# EAGLE design encoder_board (EAGLE 8.6.0)
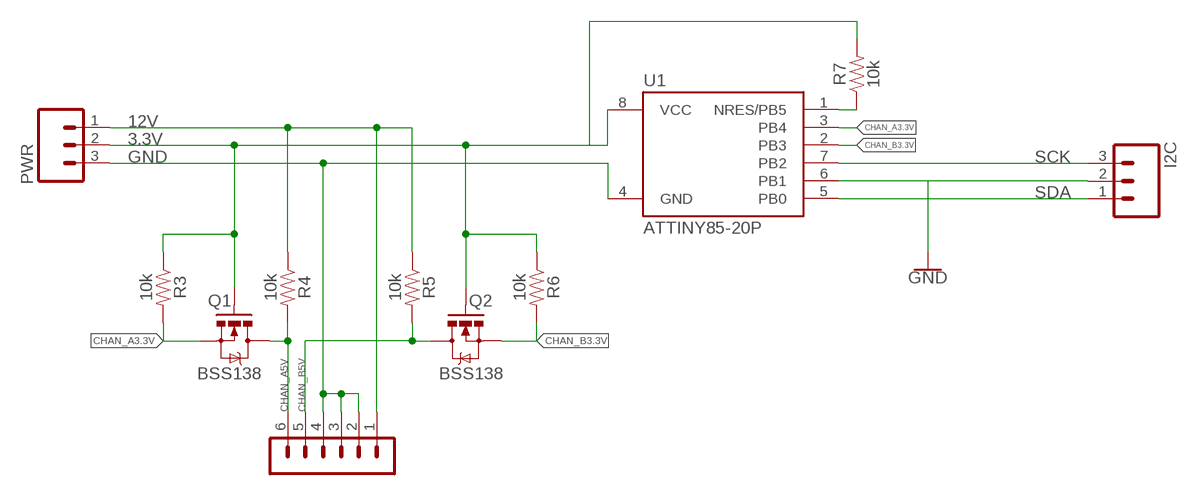
[diagram p0: schematic, sheet 1]

## Parts
ENCODER  B6B-EH-A  [B6B-EH-A]
I2C  CONN_03JST-PTH-VERT  [JST-3-PTH-VERT]
PWR  CONN_03JST-PTH-VERT  [JST-3-PTH-VERT]
Q1  BSS138  MOSFET-NCHANNELSMD  [SOT23-3]
Q2  BSS138  MOSFET-NCHANNELSMD  [SOT23-3]
R3  10k  10KOHM-HORIZ-1/4W-1%  [AXIAL-0.3]
R4  10k  10KOHM-HORIZ-1/4W-1%  [AXIAL-0.3]
R5  10k  10KOHM-HORIZ-1/4W-1%  [AXIAL-0.3]
R6  10k  10KOHM-HORIZ-1/4W-1%  [AXIAL-0.3]
R7  10k  10KOHM-HORIZ-1/4W-1%  [AXIAL-0.3]
U1  ATTINY85-20P  [PDIP08_300MIL]

## Nets
3.3V: PWR.2 Q1.1(G) Q2.1(G) R3.P$1 R6.P$1 R7.P$2 U1.8(VCC)
12V: ENCODER.1 PWR.1 R4.P$1 R5.P$1
CHAN_A3.3V: Q1.2(S) R3.P$2 U1.3(PB4)
CHAN_A5V: ENCODER.6 Q1.3(D) R4.P$2
CHAN_B3.3V: Q2.2(S) R6.P$2 U1.2(PB3)
CHAN_B5V: ENCODER.5 Q2.3(D) R5.P$2
GND: ENCODER.2 ENCODER.3 ENCODER.4 I2C.2 PWR.3 U1.4(GND) U1.6(PB1)
N$1: R7.P$1 U1.1(NRES/PB5)
SCK: I2C.3 U1.7(PB2)
SDA: I2C.1 U1.5(PB0)

## Library data of the parts
ENCODER = con-jst-eh:B6B-EH-A: HEADER
I2C PWR = SparkFun-Connectors:CONN_03: Multi connection point. Often used as Generic Header-pin footprint for 0.1 inch spaced/style header connections On any of the 0.1 inch spaced packages, you can populate with these: Break Away Headers - Straight <https://www.sparkfun.com/products/116> (PRT-00116) Break Away Male Headers - Right Angle <https://www.sparkfun.com/products/553> (PRT-00553) Female Headers <https://www.sparkfun.com/products/115> (PRT-00115) Break Away Headers - Machine Pin <https://www.sparkfun.com/products/117> (PRT-00117) Break Away Female Headers - Swiss Machine Pin <https://www.sparkfun.com/products/743> (PRT-00743) Stackable Header - 3 Pin (Female, 0.1") <https://www.sparkfun.com/products/13875> (PRT-13875) For SCREWTERMINALS and SPRING TERMINALS visit here: Screw Terimnals on SparkFun.com <https://www.sparkfun.com/search/results?term=Screw+Terminals> (5mm/3.5mm/2.54mm spacing) This device is also useful as a general connection point to wire up your design to another part of your project. Our various solder wires solder well into these plated through hole pads. Hook-Up Wire - Assortment (Stranded, 22 AWG) <https://www.sparkfun.com/products/11375> (PRT-11375) Hook-Up Wire - Assortment (Solid Core, 22 AWG) <https://www.sparkfun.com/products/11367> (PRT-11367) View the entire wire category on our website here <https://www.sparkfun.com/categories/141> Special notes: Molex polarized connector foot print use with SKU : PRT-08232 with associated crimp pins and housings.; PROD_ID: CONN-13230
Q1 Q2 = SparkFun:MOSFET-NCHANNEL
R3-R7 = SparkFun-Resistors:10KOHM: 10kΩ resistor A resistor is a passive two-terminal electrical component that implements electrical resistance as a circuit element. Resistors act to reduce current flow, and, at the same time, act to lower voltage levels within circuits. - Wikipedia; PROD_ID: RES-12183
U1 = _hhn_attiny25_45_85:ATTINY85*: ATMEL ATtiny 85 Packages: P = PDIP 08 30mil S = SOIC 08 EIAJ 208mil Technologies Note: for complete ordering code (temp. range, finish, tape&reel etc.) see www.atmel.com • Supply Voltage: V = (1.8…5.5)V | [blank] = (2.7…5.5)V • Speed: 10 = 10 MHz | 20 = 20 MHz Author: Dipl.-Ing. FH Rainer Bayer HHN Hochschule Heilbronn (Heilbronn University), rainer.bayer@hs-heilbronn.de Ingenieurbüro ing-rb, mail@ing-rb.de

## Board
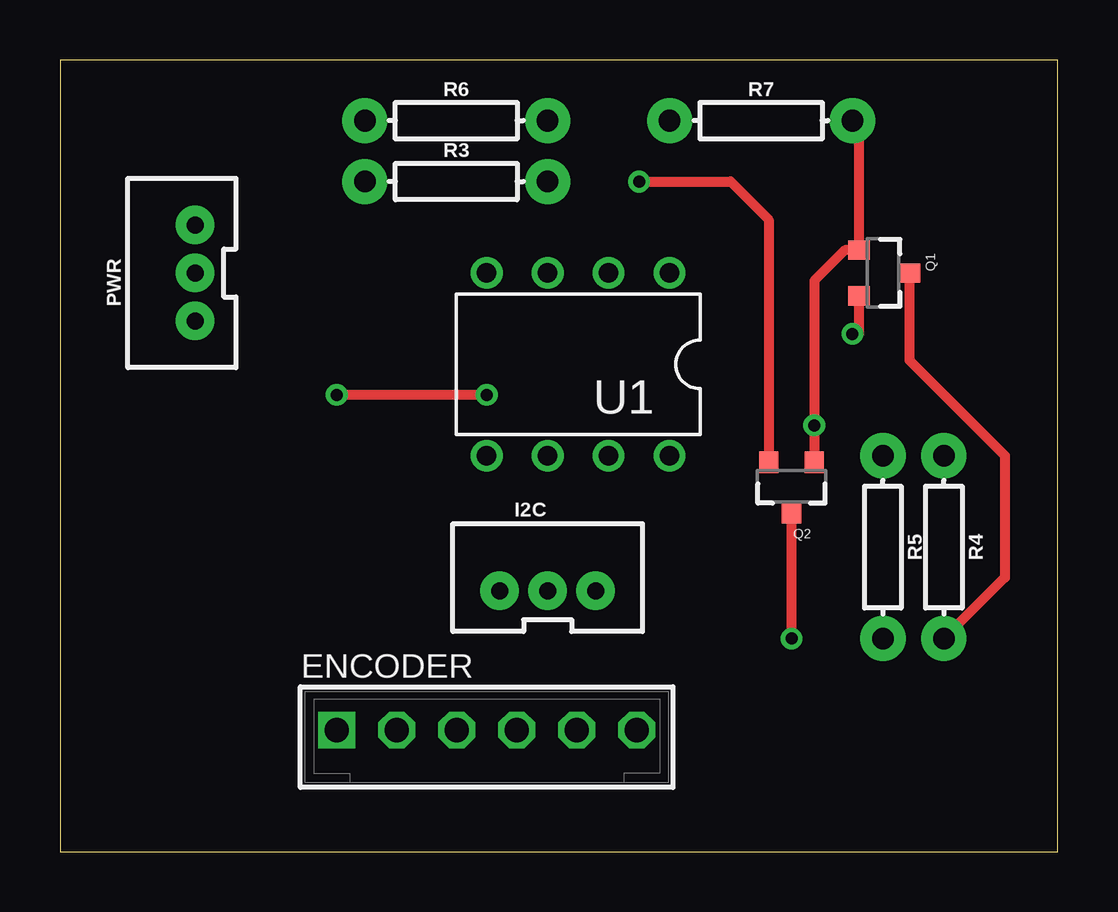
[diagram p1: board, top side]
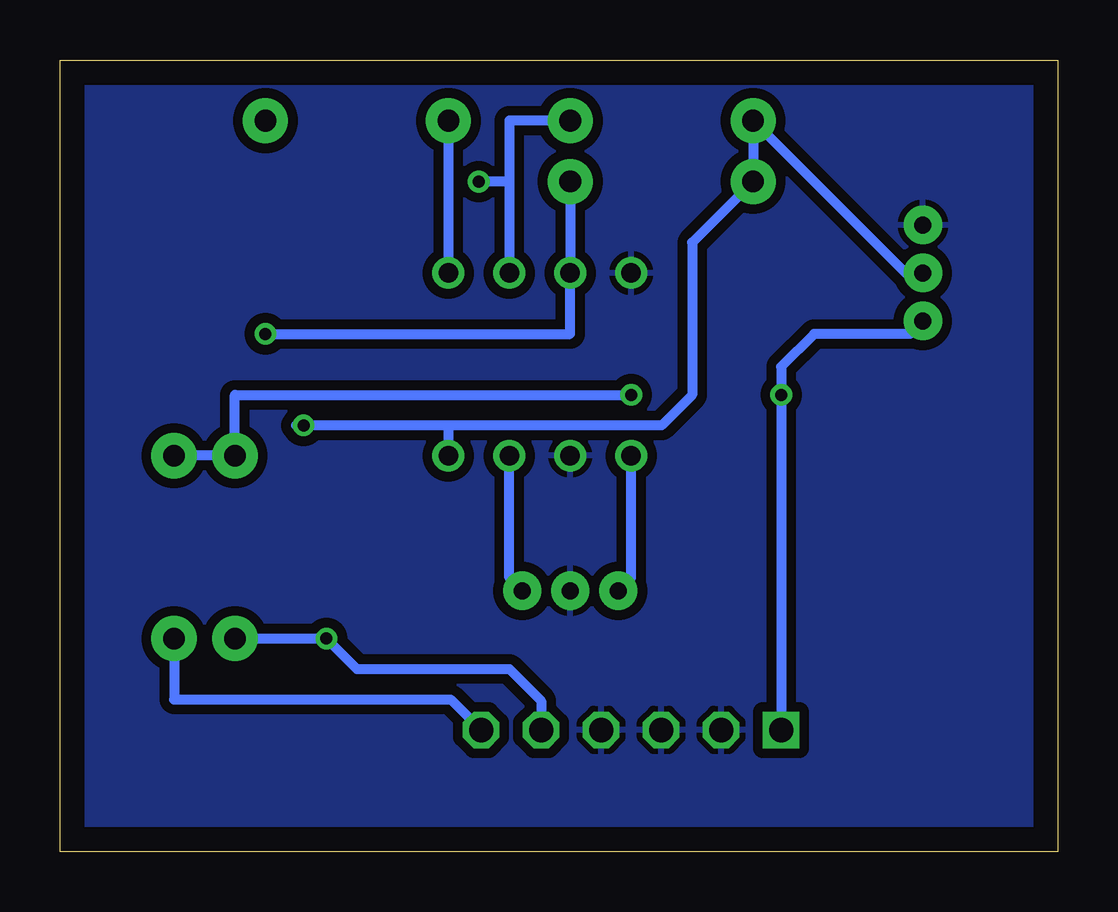
[diagram p2: board, bottom side, seen from below]

Size 41.58 x 33.01 mm. Coordinates in mm from the lower left corner, seen from the top.
Outline: 0,0 41.58,0 41.58,33.01 0,33.01 0,0
Copper layers (1*16): Top 0.035mm / dielectric 1.5mm / Bottom 0.035mm
Design rules "default": minimum track width 6mil, minimum drill 0.35mm, track to track 6mil, track to pad 6mil, pad to pad 6mil, via to via 6mil, smd to smd 6mil, copper to edge 40mil, drill to drill 6mil, minimum pad ring 10mil, minimum via ring 8mil, stop-mask expansion 4mil, vias tented up to drill 0mil, thermal gap 10mil

### Footprints (pad centres in the part's own frame; a part is rotated, then mirrored left to right if it is on the bottom)
B6B-EH-A = drill 1.016 square: 1 -6.25,0 | drill 1.016 octagon: 2 -3.75,0; 3 -1.25,0; 4 1.25,0; 5 3.75,0; 6 6.25,0
JST-3-PTH-VERT = drill 0.7 pad 1.6: 1 -2,-0.55; 2 0,-0.55; 3 2,-0.55
SOT23-3 = smd 0.8 x 0.9: 1 -0.95,-1; 2 0.95,-1; 3 0,1.1
AXIAL-0.3 = drill 0.9 pad 1.88: P$1 -3.81,0; P$2 3.81,0
PDIP08_300MIL = drill 0.813: 1 -3.81,-3.81; 2 -1.27,-3.81; 3 1.27,-3.81; 4 3.81,-3.81; 5 3.81,3.81; 6 1.27,3.81; 7 -1.27,3.81; 8 -3.81,3.81

### Placement (x,y rotation side)
ENCODER  17.78,5.08 0 top
I2C  20.32,11.43 0 top
PWR  5.08,24.13 90 top
Q1  34.29,24.13 270 top
Q2  30.48,15.24 180 top
R3  16.51,27.94 0 top
R4  36.83,12.7 270 top
R5  34.29,12.7 270 top
R6  16.51,30.48 0 top
R7  29.21,30.48 0 top
U1  21.59,20.32 180 top

### Tracks (layer width: path | path; a pad name or v marks a point on that pad's centre or on a via)
3.3V  (via drill 0.5)
  Top 0.406: R7.P$2 33.29,30.21 Q1.1 32.7,25.08 31.43,23.81 v31.43,17.78 Q2.1
  Bottom 0.406: PWR.2 6.35,24.13 R6.P$1 R3.P$1 15.24,25.4 15.24,19.05 16.51,17.78 25.4,17.78 | 25.4,17.78 U1.8 | 25.4,17.78 v31.43,17.78 31.75,17.78
12V  (via drill 0.5)
  Top 0.406: v17.78,19.05 v11.53,19.05
  Bottom 0.406: R4.P$1 R5.P$1 34.29,19.05 v17.78,19.05 | PWR.1 6.17,21.59 10.16,21.59 11.53,20.22 v11.53,19.05 ENCODER.1
CHAN_A3.3V  (via drill 0.5)
  Top 0.406: Q1.2 33.29,21.59 v33.02,21.59
  Bottom 0.406: R3.P$2 U1.3 20.32,21.59 v33.02,21.59
CHAN_A5V
  Top 0.406: Q1.3 35.39,20.49 39.37,16.51 39.37,11.43 R4.P$2
  Bottom 0.406: R4.P$2 36.83,6.35 25.3,6.35 ENCODER.6
CHAN_B3.3V  (via drill 0.5)
  Top 0.406: v24.13,27.94 27.94,27.94 29.53,26.35 Q2.2
  Bottom 0.406: R6.P$2 22.86,30.48 22.86,27.94 | 22.86,27.94 U1.2 | 22.86,27.94 v24.13,27.94
CHAN_B5V  (via drill 0.5)
  Top 0.406: v30.48,8.89 Q2.3
  Bottom 0.406: ENCODER.5 21.53,6.29 22.86,7.62 29.21,7.62 v30.48,8.89 R5.P$2
GND
  pour Bottom (isolate 0.406): -1.27,34.29 43.18,34.29 43.18,-2.54 -2.54,-2.54 -2.54,34.29
N$1
  Bottom 0.406: R7.P$1 U1.1
SCK
  Bottom 0.406: I2C.3 22.86,11.42 U1.7
SDA
  Bottom 0.406: I2C.1 17.78,11.42 U1.5